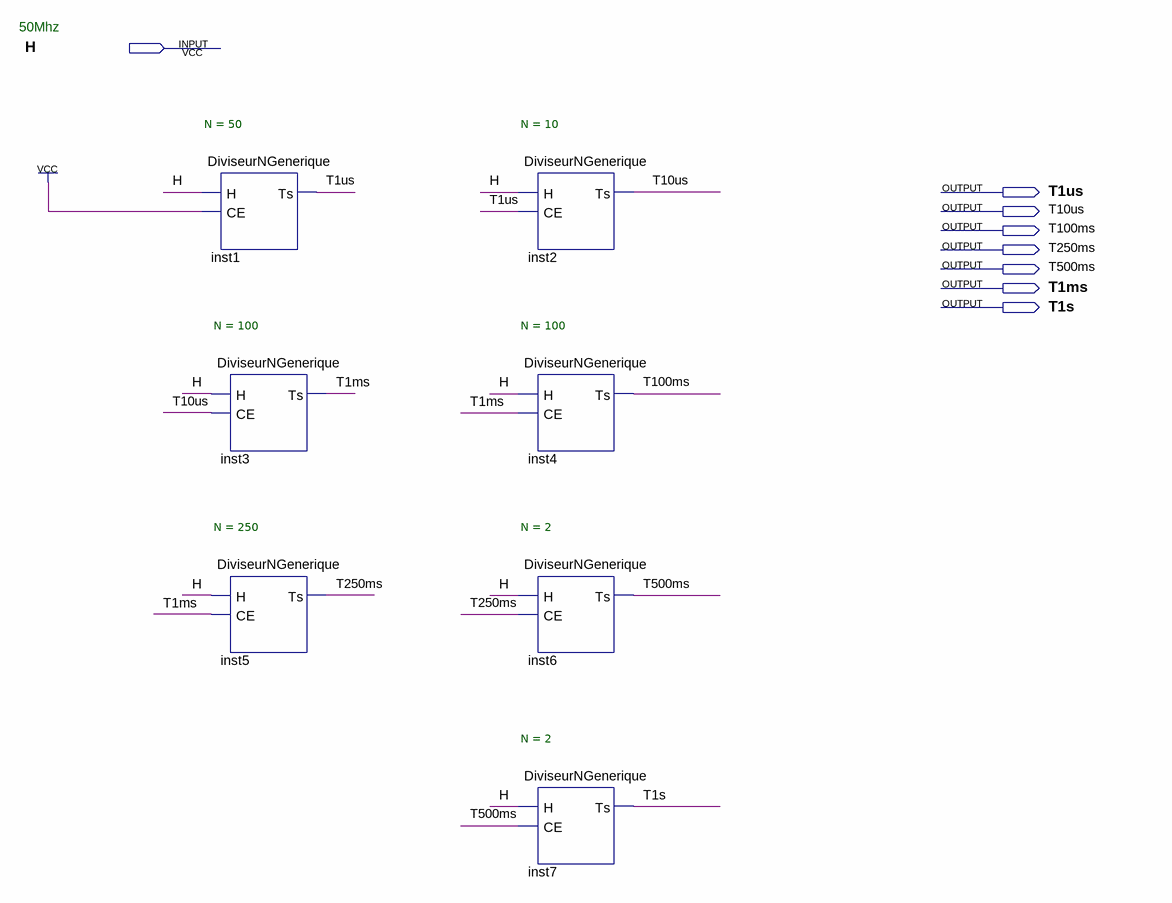
[diagram p0: schematic sheet]
// Quartus schematic BaseDeTemps.bdf as structural Verilog: 7 symbols, 8 pins
module BaseDeTemps (
  input  H,
  output T1us,
  output T10us,
  output T100ms,
  output T250ms,
  output T500ms,
  output T1ms,
  output T1s
);

  DiviseurNGenerique #(.N(50)) inst1 (.H(H), .CE(1'b1), .Ts(T1us));
  DiviseurNGenerique #(.N(100)) inst3 (.H(H), .CE(T10us), .Ts(T1ms));
  DiviseurNGenerique #(.N(250)) inst5 (.H(H), .CE(T1ms), .Ts(T250ms));
  DiviseurNGenerique #(.N(10)) inst2 (.H(H), .CE(T1us), .Ts(T10us));
  DiviseurNGenerique #(.N(100)) inst4 (.H(H), .CE(T1ms), .Ts(T100ms));
  DiviseurNGenerique #(.N(2)) inst6 (.H(H), .CE(T250ms), .Ts(T500ms));
  DiviseurNGenerique #(.N(2)) inst7 (.H(H), .CE(T500ms), .Ts(T1s));

  // Notes on the sheet:
  //   50Mhz
endmodule
